# Altium schematic sheet de30.SchDoc
size A4; SheetNumber: 1; SheetTotal: 1; SPICEModelCacheCSSOZDUF: <root> / <DocumentId>CSSOZDUF</DocumentId> / <CacheFrame Number="0"> / <Model Name="zener" Kind="MDL"> / <Text>*ZENER / *Default Zener 10V @ 10mA / *Zener Diode Pinout: A,K / .MODEL ZENER D( BV=10 IBV=10E-3 )</Text> / </Model> / <Model Name="2n3906" Kind="MDL"> / <Text>*2N3906 / *Si 310mW  40V 200mA 250MHz pkg:TO-92B 1,2,3 / .MODEL 2N3906 PNP(IS=4E-14 BF=400 VAF=50 IKF=0.02 ISE=7E-15 NE=1.16 / + BR=7.5 RC=2.4 CJE=6.3E-12 VJE=0.75 TF=5E-10 CJC=5.8E-12 VJC=0.75 TR=2.3E-8 / + VJS=0.75 XTB=1.5 KF=6E-16 )</Text> / </Model> / <Model Name="diode" Kind="MDL"> / <Text>*Default Diode / *Diode Pinout: A,K / .MODEL DIODE D()</Text> / </Model> / <Model Name="led0" Kind="MDL"> / <Text>*Typ INFRARED GaAs LED: Vf=1.2V Vr=5V If=40mA trr=3uS / *LED Pinout: 1=A, 2=K / .MODEL LED0 D (IS=93.5P RS=84M N=2.63 BV=5 IBV=10U / + CJO=2.97P VJ=.75 M=.333 TT=4.32U)</Text> / </Model> / <Model Name="2n3904" Kind="MDL"> / <Text>*2N3904 / *Si 310mW  40V 200mA 300MHz pkg:TO-92B 1,2,3 / .MODEL 2N3904 NPN(IS=1.4E-14 BF=300 VAF=100 IKF=0.025 ISE=3E-13 / + BR=7.5 RC=2.4 CJE=4.5E-12 TF=4E-10 CJC=3.5E-12 TR=2.1E-8 XTB=1.5 KF=9E-16 )</Text> / </Model> / </CacheFrame> / </root>
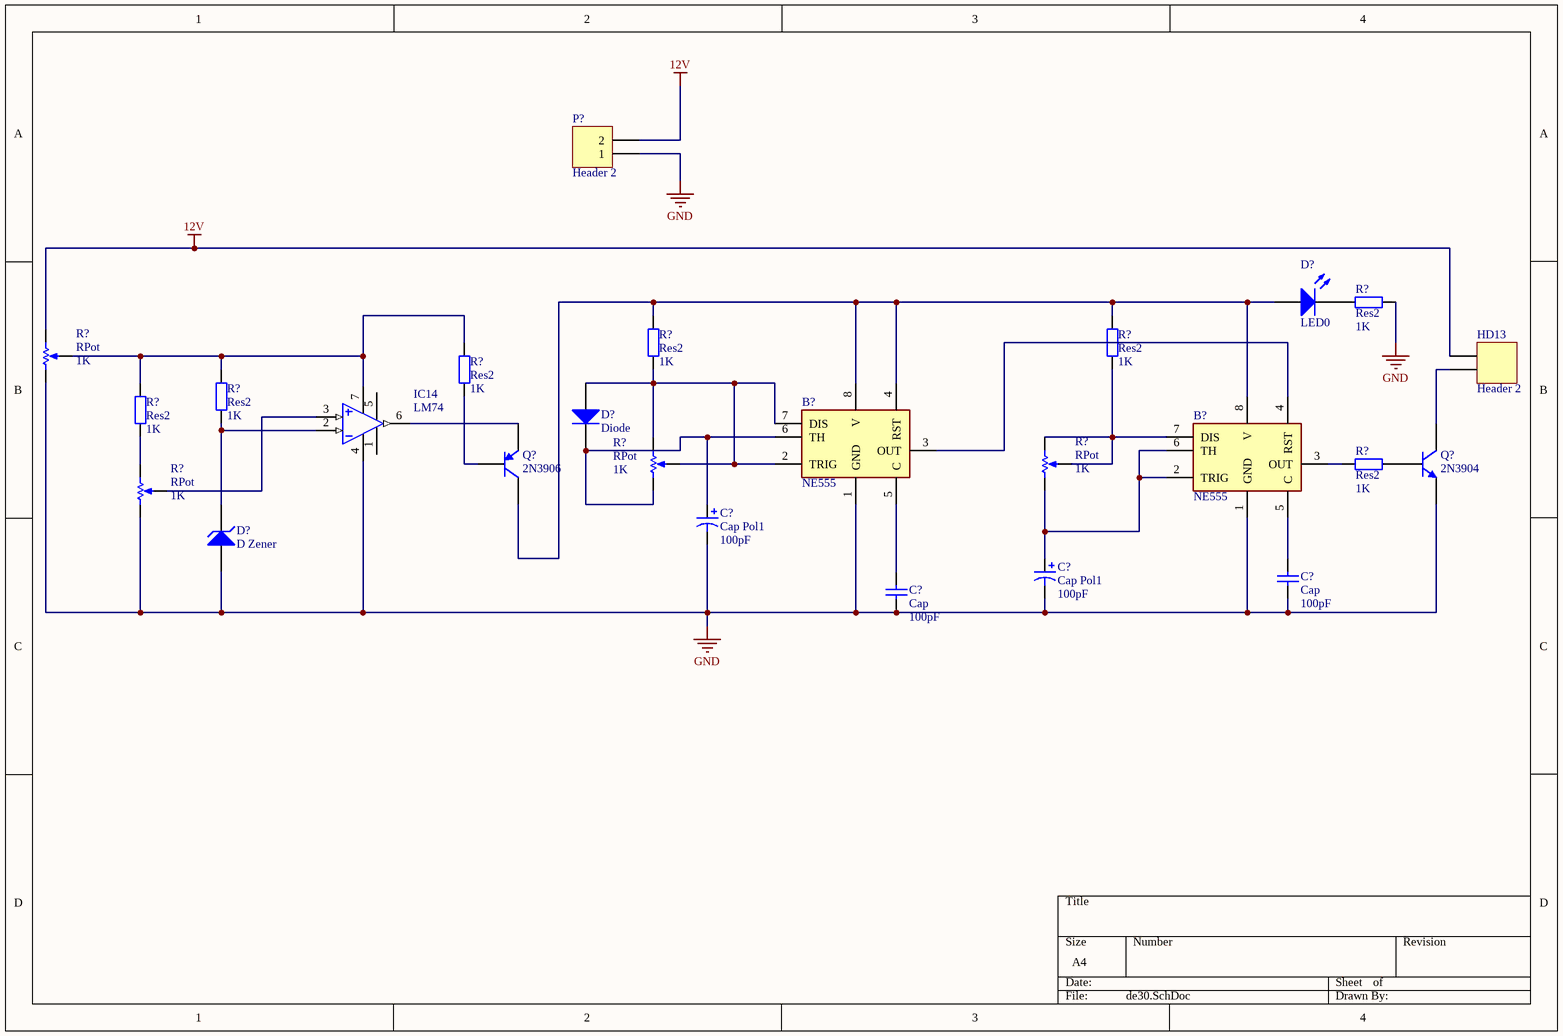
[diagram p0: de30.SchDoc]

## Parts
(Parts that share a designator on the sheet are numbered #1, #2 ... from top to bottom, then left to right.)
B?#1  NE555  [SOIC127P600X175-8N]
B?#2  NE555  [SOIC127P600X175-8N]
C?#1  Cap Pol1  value 100pF  [RB7.6-15]
C?#2  Cap Pol1  value 100pF  [RB7.6-15]
C?#3  Cap  value 100pF  [RAD-0.3]
C?#4  Cap  value 100pF  [RAD-0.3]
D?#1  LED0  [LED-0]
D?#2  Diode  [SMC]
D?#3  D Zener  [DIODE-0.7]
HD13  Header 2  [HDR1X2]
IC14  LM74
P?  Header 2  [HDR1X2]
Q?#1  2N3906  [TO-92A]
Q?#2  2N3904  [TO-92A]
R?#1  Res2  value 1K  [AXIAL-0.4]
R?#2  Res2  value 1K  [AXIAL-0.4]
R?#3  Res2  value 1K  [AXIAL-0.4]
R?#4  RPot  value 1K  [VR5]
R?#5  Res2  value 1K  [AXIAL-0.4]
R?#6  Res2  value 1K  [AXIAL-0.4]
R?#7  Res2  value 1K  [AXIAL-0.4]
R?#8  Res2  value 1K  [AXIAL-0.4]
R?#9  RPot  value 1K  [VR5]
R?#10  RPot  value 1K  [VR5]
R?#11  RPot  value 1K  [VR5]

## Nets
12V: HD13.1 P?.2 R?#4.2(BOT)
GND: B?#1.1(GND) B?#2.1(GND) C?#1.2 C?#2.2 C?#3.1 C?#4.1 D?#3.1(A) IC14.4 P?.1 Q?#2.1(E) R?#1.2 R?#4.1(TOP) R?#11.1(TOP)
NetB?#1_2: B?#1.2(TRIG) B?#1.7(DIS) D?#2.1(A) R?#2.1 R?#9.2(BOT) R?#9.3(TAP)
NetB?#1_3: B?#1.3(OUT) B?#2.4(RST)
NetB?#1_4: B?#1.4(RST) B?#1.8(V) B?#2.8(V) D?#1.1(A) Q?#1.3(C) R?#2.2 R?#3.2
NetB?#1_5: B?#1.5(C) C?#4.2
NetB?#1_6: B?#1.6(TH) C?#1.1 D?#2.2(K) R?#9.1(TOP)
NetB?#2_2: B?#2.2(TRIG) B?#2.6(TH) C?#2.1 R?#10.1(TOP)
NetB?#2_3: B?#2.3(OUT) R?#8.1
NetB?#2_5: B?#2.5(C) C?#3.2
NetB?#2_7: B?#2.7(DIS) R?#3.1 R?#10.2(BOT) R?#10.3(TAP)
NetD?#1_2: D?#1.2(K) R?#1.1
NetD?#3_2: D?#3.2(K) IC14.2 R?#6.1
NetHD13_2: HD13.2 Q?#2.3(C)
NetIC14_3: IC14.3 R?#11.3(TAP)
NetIC14_6: IC14.6 Q?#1.1(E)
NetIC14_7: IC14.7 R?#4.3(TAP) R?#5.2 R?#6.2 R?#7.2
NetQ?#1_2: Q?#1.2(B) R?#5.1
NetQ?#2_2: Q?#2.2(B) R?#8.2
NetR?#7_1: R?#7.1 R?#11.2(BOT)

Not connected (* = marked no-connect by the designer): IC14 1 5

## Library data of the parts
B?#1 B?#2 = NE555: Timers & Support Products; Manufacturer_Name: Diodes Incorporated; Geometry.Height: 1.75mm; Manufacturer_Part_Number: NE555; Mouser Part Number: N/A; Mouser Price/Stock: https://www.mouser.co.uk/ProductDetail/Diodes-Incorporated/NE555?qs=Wj%2FVkw3K%252BMDvMoYkR61Dtg%3D%3D; Arrow Part Number: *; Arrow Price/Stock: *; Datasheet Link: https://www.datasheet.com/bav99.pdf
C?#1 C?#2 = Cap Pol1: Polarized Capacitor (Radial); Published: 8-Jun-2000; LatestRevisionDate: 17-Jul-2002; LatestRevisionNote: Re-released for DXP Platform.; PackageReference: RB7.6-15; Publisher: Altium Limited; PackageDescription: Polarized Capacitor (Radial); 2 Leads
C?#3 C?#4 = Cap: Capacitor; Published: 8-Jun-2000; LatestRevisionDate: 17-Jul-2002; LatestRevisionNote: Re-released for DXP Platform.; PackageReference: RAD-0.3; Publisher: Altium Limited; PackageDescription: Radial Cap, Thru-Hole; 2 Leads; 0.3 in Pin Spacing
D?#1 = LED0: Typical INFRARED GaAs LED; Published: 8-Jun-2000; LatestRevisionDate: 08-Jul-2005; LatestRevisionNote: Mech Layer 1 removed.; PackageReference: LED-0; Publisher: Altium Limited; PackageDescription: LED; 2 Leads
D?#2 = Diode: Default Diode; Published: 8-Jun-2000; LatestRevisionDate: 17-Jul-2002; LatestRevisionNote: Re-released for DXP Platform.; PackageVersion: Sep-1996; PackageReference: SMC; Publisher: Altium Limited; PackageDescription: DO-214-AB/SMC; 2 C-Bend Leads; Body 7.9 x 5.9 mm, inc. leads (LxW); Code_JEDEC: DO-214-AB
D?#3 = D Zener: Zener Diode; Published: 8-Jun-2000; LatestRevisionDate: 17-Jul-2002; LatestRevisionNote: Re-released for DXP Platform.; PackageReference: DIODE-0.7; Publisher: Altium Limited; PackageDescription: Diode, Thru-Hole; 2 Leads; 0.7 in Pin Spacing
HD13 P? = Header 2: Header, 2-Pin; LatestRevisionDate: 17-Jul-2002; LatestRevisionNote: Re-released for DXP Platform.; Publisher: Altium Limited
IC14 = Component_1
Q?#1 = 2N3906: PNP General Purpose Amplifier; Published: 8-Jun-2000; LatestRevisionDate: 15-Jan-2003; LatestRevisionNote: PCB Footprint 'BCY-W3/D4.7' replaced; DatasheetVersion: 1997; PackageVersion: Sep-1998; PackageReference: TO-92A; Publisher: Altium Limited; PackageDescription: TO, Flat Index; 3 In-Line, Axial Leads; Body Dia. 4.5mm; Leads 0.51 x 0.48 mm (max); ComponentLink1Description: Manufacturer Link; ComponentLink1URL: http://www.fairchildsemi.com/; ComponentLink2Description: Datasheet; ComponentLink2URL: http://www.fairchildsemi.com/ds/2N%2F2N3906.pdf
Q?#2 = 2N3904: NPN General Purpose Amplifier; Published: 8-Jun-2000; LatestRevisionDate: 15-Jan-2003; LatestRevisionNote: PCB Footprint 'BCY-W3/D4.7' replaced; DatasheetVersion: 1997; PackageVersion: Sep-1998; PackageReference: TO-92A; Publisher: Altium Limited; PackageDescription: TO, Flat Index; 3 In-Line, Axial Leads; Body Dia. 4.5mm; Leads 0.51 x 0.48 mm (max); ComponentLink1Description: Manufacturer Link; ComponentLink1URL: http://www.fairchildsemi.com/; ComponentLink2Description: Datasheet; ComponentLink2URL: http://www.fairchildsemi.com/ds/2N%2F2N3904.pdf
R?#1-R?#3 R?#5-R?#8 = Res2: Resistor; Published: 8-Jun-2000; LatestRevisionDate: 17-Jul-2002; LatestRevisionNote: Re-released for DXP Platform.; PackageReference: AXIAL-0.4; Publisher: Altium Limited; PackageDescription: Axial Device, Thru-Hole; 2 Leads; 0.4 in Pin Spacing
R?#4 R?#9-R?#11 = RPot: Potentiometer; Sim Note: Enter the Resistance value and the set point into parameter fields.; Set Position: 0.5; Published: 8-Jun-2000; LatestRevisionDate: 17-Jul-2002; LatestRevisionNote: Re-released for DXP Platform.; PackageReference: VR5; Publisher: Altium Limited; PackageDescription: Variable Resistor, Thru-Hole; 3 Leads